# Altium project Driver_Modulation.PrjPcb (part 1 of 2)
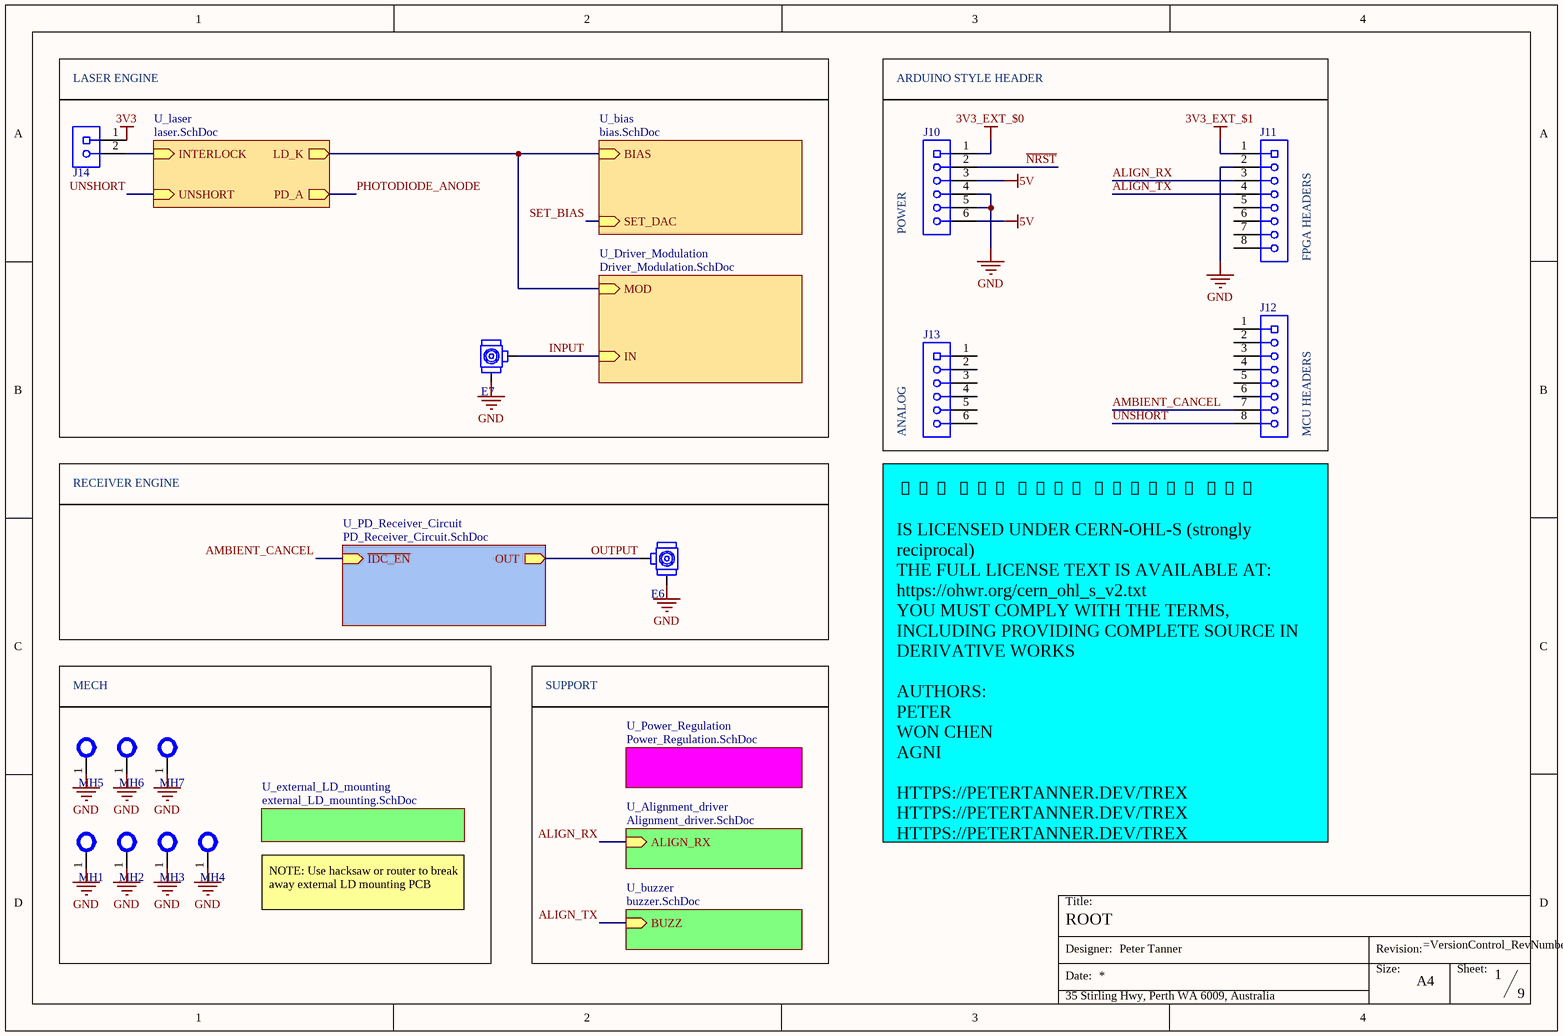
[diagram p0: ROOT.SchDoc]
9 sheets, 150 parts. Net scope: hierarchical (ports join the sheet entries above them; power ports are global).
Board file: Driver_Modulation.PcbDoc
Sheets:
  ROOT.SchDoc
    U_laser = laser.SchDoc
    U_bias = bias.SchDoc
    U_Driver_Modulation = Driver_Modulation.SchDoc
    U_Power_Regulation = Power_Regulation.SchDoc
    U_PD_Receiver_Circuit = PD_Receiver_Circuit.SchDoc
    U_Alignment_driver = Alignment_driver.SchDoc
    U_buzzer = buzzer.SchDoc
    U_external_LD_mounting = external_LD_mounting.SchDoc

## Sheet ROOT.SchDoc: ROOT
size A4; Author: Peter Tanner; SheetNumber: 1; SheetTotal: 9; SPICEModelCacheOJDLQUBK: <root> / <DocumentId>OJDLQUBK</DocumentId> / </root>

### Parts
E6  U.FL-R-SMT-1(01)  [HRS-U.FL-R-SMT-3_V 4_LAYER_KO]  (value not drawn)
E7  U.FL-R-SMT-1(01)  [HRS-U.FL-R-SMT-3_V 4_LAYER_KO]  (value not drawn)
J10  68000-406HLF  [68000-406HLF-Footprint-1]  (value not drawn)
J11  22-28-4080  [22-28-4080-Footprint-1]  (value not drawn)
J12  22-28-4080  [22-28-4080-Footprint-1]  (value not drawn)
J13  68000-406HLF  [68000-406HLF-Footprint-1]  (value not drawn)
J14  22-28-4020  [22-28-4020-Footprint-1]  (value not drawn)
MH1  Mounting hole M3  [Mounting hole M3-Footprint-1]  (value not drawn)  (no BOM)
MH2  Mounting hole M3  [Mounting hole M3-Footprint-1]  (value not drawn)  (no BOM)
MH3  Mounting hole M3  [Mounting hole M3-Footprint-1]  (value not drawn)  (no BOM)
MH4  Mounting hole M3  [Mounting hole M3-Footprint-1]  (value not drawn)  (no BOM)
MH5  Mounting hole M3  [Mounting hole M3-Footprint-1]  (value not drawn)  (no BOM)
MH6  Mounting hole M3  [Mounting hole M3-Footprint-1]  (value not drawn)  (no BOM)
MH7  Mounting hole M3  [Mounting hole M3-Footprint-1]  (value not drawn)  (no BOM)

### Blocks framed on the sheet
LASER ENGINE: E7 J14
RECEIVER ENGINE: E6
MECH: MH1-MH7

### Sub-sheets
U_Alignment_driver = Alignment_driver.SchDoc: ALIGN_RX (in)
U_bias = bias.SchDoc: BIAS (in), SET_DAC (in)
U_buzzer = buzzer.SchDoc: BUZZ (in)
U_Driver_Modulation = Driver_Modulation.SchDoc: IN (in), MOD (in)
U_external_LD_mounting = external_LD_mounting.SchDoc: no entries
U_laser = laser.SchDoc: PD_A (out), LD_K (out), UNSHORT (in), INTERLOCK (in)
U_PD_Receiver_Circuit = PD_Receiver_Circuit.SchDoc: OUT (out), ~{IDC_EN} (in)
U_Power_Regulation = Power_Regulation.SchDoc: no entries

### Nets
3V3: J14.1
3V3_EXT_$0: J10.1
3V3_EXT_$1: J11.1
5V: J10.3 J10.6
GND: E6.2(GND) E7.2(GND) J10.4 J10.5 J11.2 MH1.1 MH2.1 MH3.1 MH4.1 MH5.1 MH6.1 MH7.1
~{NRST}: J10.2
ALIGN_RX: J11.3 ; sheet U_Alignment_driver/ALIGN_RX
ALIGN_TX: J11.4 ; sheet U_buzzer/BUZZ
AMBIENT_CANCEL: J12.7 ; sheet U_PD_Receiver_Circuit/~{IDC_EN}
INPUT: E7.1(SIG) ; sheet U_Driver_Modulation/IN
LD_K: sheet U_laser/LD_K, sheet U_bias/BIAS, sheet U_Driver_Modulation/MOD
OUTPUT: E6.1(SIG) ; sheet U_PD_Receiver_Circuit/OUT
UNSHORT: J12.8 ; sheet U_laser/UNSHORT
NetJ14_2: J14.2 ; sheet U_laser/INTERLOCK

Not connected (* = marked no-connect by the designer): J11 5 6 7 8; J12 1 2 3 4 5 6; J13 1 2 3 4 5 6

### Notes on the sheet
- ARDUINO STYLE HEADER
- (near J10) POWER
- (near J11) FPGA HEADERS
- (near J13) ANALOG
- (near J12) MCU HEADERS
- SUPPORT
- 🦖🦖🦖 THE TREX SYSTEM 🦖🦖🦖
  IS LICENSED UNDER CERN-OHL-S (strongly reciprocal)
  THE FULL LICENSE TEXT IS AVAILABLE AT:
  https://ohwr.org/cern_ohl_s_v2.txt
  YOU MUST COMPLY WITH THE TERMS, INCLUDING PROVIDING COMPLETE SOURCE IN DERIVATIVE WORKS
  AUTHORS:
  PETER
  WON CHEN
  AGNI
  HTTPS://PETERTANNER.DEV/TREX
  HTTPS://PETERTANNER.DEV/TREX
  HTTPS://PETERTANNER.DEV/TREX
- NOTE: Use hacksaw or router to break away external LD mounting PCB
- Title:
- Designer:
- Date:
- Size:
- Revision:
- A4
- Sheet:
- 35 Stirling Hwy, Perth WA 6009, Australia

### Library data of the parts
E6 E7 = CMP-00380-18: Rf Connectors / Coaxial Connectors SMT Ml Rec Au 50 Ohm W/anti Sldr Wicking UFL; Number of Ports: 1; Dielectric Material: Polymer; Impedance: 50; Mating Cycles: 30; Connector Type: Receptacle,Male Pin; Body Plating: Silver; Center Contact Plating: Gold; Max Frequency: 6GHz; Body Material: Bronze; Lead Free: Lead Free; Series: U.FL; JLC PN: C88374; Contact Material: Brass; Fastening Type: SNAP-ON; Min Operating Temperature: -40°C; RoHS Compliant: Yes; Housing Color: Beige; Depth: 3mm; Contact Plating: Gold; Mount: Surface Mount; Length: 3.1mm; Orientation: Vertical; Termination: Solder; Max Operating Temperature: 90°C; Source: UWAA_Stock
J10 = CMP-00021-4: CONN HEADER 6POS .100 STR TIN; Gender: Male; Insulation Resistance: 5G; Voltage Rating: 1.5kV; Pitch: 2.54mm; Connector Type: Male Pin; Current Rating: 3A; Number of Contacts: 6; Depth: 2.41mm; Orientation: Straight; Max Operating Temperature: 125°C; Number of Rows: 1; Length: 15.24mm; Termination: Solder; Min Operating Temperature: -65°C; Housing Material: Thermoplastic; Contact Material: Bronze; Contact Plating: Tin; Housing Color: Black; RoHS Compliant: Unsure; Source: Aliexpress
J11 J12 = CMP-00439-4: Conn Unshrouded Header HDR 8 POS 2.54mm Solder ST Thru-Hole Bag; Number of Contacts: 8; Voltage Rating: 250V; Contact Resistance: 20m; Gender: Male; Current Rating: 4A; Connector Type: Male Pin; Max Operating Temperature: 75°C; Orientation: Straight; Depth: 2.49mm; Housing Color: Black; Pitch: 2.54mm; Housing Material: Thermoplastic; Min Operating Temperature: 0°C; Contact Material: Brass,Bronze; Contact Plating: Tin; RoHS Compliant: Yes; Number of Rows: 1; Termination: Solder; Mounting Technology: Through-Hole; Source: Aliexpress
J13 = CMP-00021-3: CONN HEADER 6POS .100 STR TIN; Max Voltage Rating (AC): 1.5kV; Contact Post Length: 2.41mm; Gender: Male; Insulation Resistance: 5GR; Pitch: 2.54mm; Connector Type: Male Pin; Current Rating: 3A; Number of Contacts: 6; Depth: 2.41mm; Package Quantity: 100; Packaging: Bulk; Orientation: Straight; REACH SVHC: No SVHC; Contact Gender: Male; Max Operating Temperature: 125°C; Number of Rows: 1; Length: 15.24mm; Termination: Solder; Radiation Hardening: No; Flammability Rating: UL94 V-0; Color: Black; Min Operating Temperature: -65°C; Contact Mating Length: 0.23inch; Voltage Rating: 1.5kV; Housing Material: Thermoplastic; Contact Material: Bronze; Contact Plating: Tin; Mount: Through Hole; Housing Color: Black; Number of Positions: 6
J14 = CMP-00157-5: KK 254 Breakaway Header, Vertical, 2 Circuits, Tin (Sn) Plating, Mating Pin Length 6.09mm 2 POS; Voltage Rating: 250V; Current Rating: 4A; Pitch: 2.54mm; Contact Resistance: 20m; Gender: Male; Connector Type: Male Pin; Number of Contacts: 2; RoHS Compliant: Unsure; Orientation: Straight; Number of Rows: 1; Housing Material: Nylon; Contact Material: Brass,Bronze; Housing Color: Black; Depth: 2.49mm; Source: Aliexpress; Mounting Technology: Through Hole; Max Operating Temperature: 75°C; Contact Plating: Tin; Termination: Solder; Min Operating Temperature: 0°C
MH1-MH7 = CMP-00600-10: Close fit Di3.2 mm Alt: M3 nut flange

## Sheet laser.SchDoc: Laser
size A4; Author: Peter Tanner; SheetNumber: 6; SheetTotal: 9; SPICEModelCacheEYCFJCLC: <root> / <DocumentId>EYCFJCLC</DocumentId> / <CacheFrame Number="0"> / <Model Name="si2302cds" Kind="CKT"> / <Text>*August 11, 2008 / *Doc. ID: 68508, S-81826, Rev. A / *File Name: Si2302CDS_PS.txt and Si2302CDS_PS.lib / *This document is intended as a SPICE modeling guideline and does not / *constitute a commercial product data sheet.  Designers should refer to the / *appropriate data sheet of the same number for guaranteed specification / *limits. / .SUBCKT Si2302CDS D G S / M1  3  GX S S NMOS W=273327u L=0.250u / M2  S  GX S D PMOS W=273327u L=0.235u / RG  G  GX     4 / R1  D  3      RTEMP 18E-3 / CGS GX S      201E-12 / DBD S  D      DBD / *********************************************************** / .MODEL  NMOS       NMOS ( LEVEL  = 3        TOX    = 1.7E-8 / + RS     = 18E-3          RD     = 0        NSUB   = 2.45E17 / + KP     = 2.8E-5         UO     = 650 / + VMAX   = 0              XJ     = 5E-7     KAPPA  = 3E-2 / + ETA    = 1E-4           TPG    = 1 / + IS     = 0              LD     = 0 / + CGSO   = 0              CGDO   = 0        CGBO   = 0 / + NFS    = 0.8E12         DELTA  = 0.1) / ************************************************************ / .MODEL  PMOS       PMOS ( LEVEL  = 3        TOX    = 1.7E-8 / +NSUB    = 2E17           IS     = 0        TPG    = -1) / ************************************************************ / .MODEL DBD D (CJO=60E-12 VJ=0.38 M=0.26 / +FC=0.5 TT=4.71E-8 T_MEASURED=25 BV=21 / +RS=4.856e-02 N=1.214 IS=5.289e-09 IKF=1000 / +EG=5.600e-01 XTI=8.258 TRS1=2.944e-12) / ************************************************************ / .MODEL RTEMP RES (TC1=8E-3 TC2=5.5E-6) / ************************************************************ / .ENDS</Text> / </Model> / <Model Name="di_1n5819" Kind="MDL"> / <Text>*SRC=1N5819;DI_1N5819;Diodes;Si;  40.0V  1.00A  3.00us   Diodes Inc. Schottky Barrier Rectifier / .MODEL DI_1N5819 D  ( IS=390n RS=0.115 BV=40.0 IBV=1.00m / + CJO=203p  M=0.333 N=1.70 TT=4.32u )</Text> / </Model> / </CacheFrame> / </root>
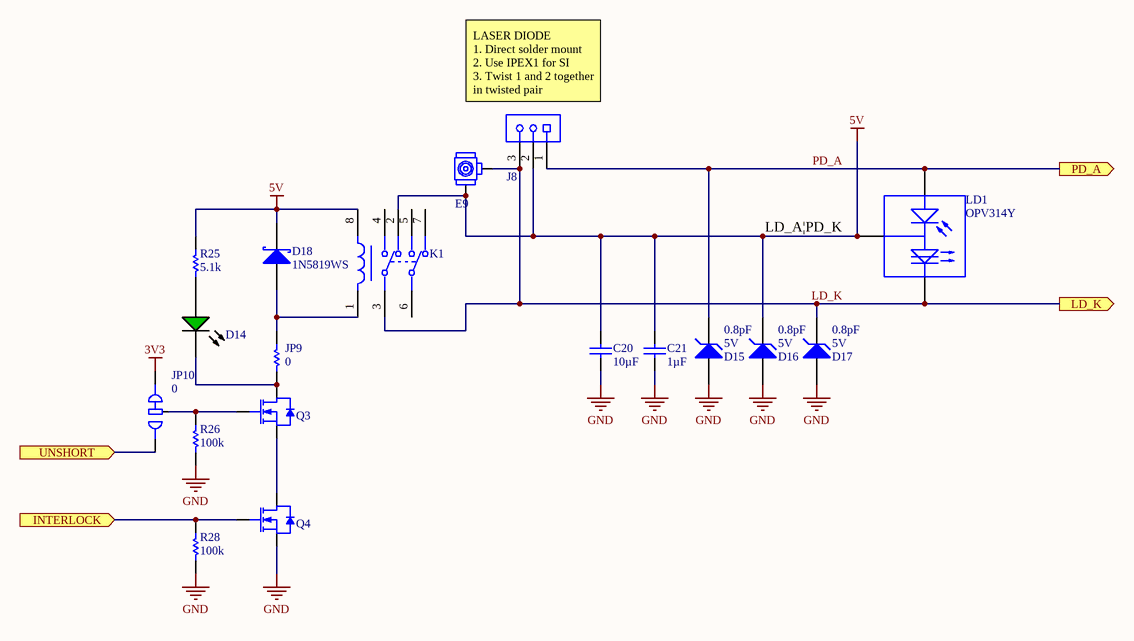
[diagram p1: laser.SchDoc]

### Parts
C20  value 10µF  [CAPC1005X06N]  (hidden comment: CL05A106MQ5NUNC)
C21  value 1µF  [CAPC1005X06N]  (hidden comment: CL05A105KA5NQNC)
D14  KT-0805G  [LED_0805]  (value not drawn)
D15  value 5V  Capacitance: 0.8pF  [DFN60P100X45-2L]  (hidden comment: H5VU10U)
D16  value 5V  Capacitance: 0.8pF  [DFN60P100X45-2L]  (hidden comment: H5VU10U)
D17  value 5V  Capacitance: 0.8pF  [DFN60P100X45-2L]  (hidden comment: H5VU10U)
D18  1N5819WS  [SODFL250X100-2N]
E9  U.FL-R-SMT-1(01)  [HRS-U.FL-R-SMT-3_V 4_LAYER_KO]  (value not drawn)
J8  B3B-PH-K-S(LF)(SN)  [JST-B3B-PH-K-S-3_V]  (value not drawn)
JP9  value 0  [RESC1005X04N]  (hidden comment: 0402WGF0000TCE)
JP10  value 0  [RESC1005X04N TWO STATE]  (hidden comment: JUMPER-0402 TWO STATE)
K1  AGQ200A4HX  [FP-AGQ200S03Z-MFG]  (value not drawn)
LD1  OPV314Y  [TO-18]
Q3  MDD2302  [SOT95P252X140-3N]  (value not drawn)
Q4  MDD2302  [SOT95P252X140-3N]  (value not drawn)
R25  value 5.1k  [RESC1005X04N]  (hidden comment: 0402WGF5101TCE)
R26  value 100k  [RESC1005X04N]  (hidden comment: CRCW0402100KFKEDC)
R28  value 100k  [RESC1005X04N]  (hidden comment: CRCW0402100KFKEDC)

### Ports
INTERLOCK (in), LD_K (out), PD_A (out), UNSHORT (in)

### Nets
3V3: JP10.2
5V: C20.2 C21.2 D16.1(K) D18.1(K) E9.2(GND) J8.2 K1.2 K1.8 LD1.2(COM) R25.2
GND: C20.1 C21.1 D15.2(A) D16.2(A) D17.2(A) Q4.2(S) R26.1 R28.1
LD_K: D17.1(K) E9.1(SIG) J8.3 K1.3 LD1.1(LD_K) ; port LD_K
PD_A: D15.1(K) J8.1 LD1.3(PD_A) ; port PD_A
UNSHORT: JP10.1 ; port UNSHORT
NetD14_1: D14.1(K) JP9.1 Q3.3(D)
NetD14_2: D14.2(A) R25.1
NetD18_2: D18.2(A) JP9.2 K1.1
NetJ14_2: Q4.1(G) R28.2 ; port INTERLOCK
NetJP10_3: JP10.3(COM) Q3.1(G) R26.2
NetQ3_2: Q3.2(S) Q4.3(D)

Not connected (* = marked no-connect by the designer): K1 4 5 6 7

### Notes on the sheet
- (near J8) LASER DIODE
  1. Direct solder mount
  2. Use IPEX1 for SI
  3. Twist 1 and 2 together in twisted pair
- (near LD1) LD_A|PD_K
- Title:
- Designer:
- Date:
- Size:
- Revision:
- A4
- Sheet:
- 35 Stirling Hwy, Perth WA 6009, Australia

### Library data of the parts
C20 = CMP-00663-2: Cap Ceramic 10uF 6.3V X5R 20% SMD 0402 85°C Paper T/R; Source: JLCPCB(Basic); JLC_PN: C15525; Tolerance: 20%; Case Code (Imperial): 0402; Voltage Rating: 6.3V; RoHS Compliant: Yes; Dielectric: X5R
C21 = CMP-00190-9: Ceramic Capacitor, Multilayer, Ceramic, 25V, 10% +Tol, 10% -Tol, X5R, 15% TC, 1uF, Surface Mount, 0402; JLC_PN: C52923; RoHS Compliant: Yes; Source: JLCPCB(Basic); Voltage Rating: 25V; Case Code (Imperial): 0402; Dielectric: X5R; Tolerance: 10%
D14 = CMP-00712-3: Emerald 0805  Light Emitting Diodes (LED) ROHS green; Forward Voltage: 2.8V; Wavelength: 520nm; Color: Emerald; Source: JLCPCB(Basic); JLC_PN: C2297; Case Code (Imperial): 0805; RoHS Compliant: Unsure
D15-D17 = CMP-00841-4: 5A 55W 16V 9V Unidirectional 5V DFN1006-2L  ESD and Surge Protection (TVS/ESD) ROHS; Breakdown Voltage: 9V; Source: JLCPCB(Basic); JLC_PN: C22395519; Polarity: Unidirectional; RoHS Compliant: Unsure; Package: DFN1006-2L; Peak Pulse Power Dissipation: 55W; Clamping Voltage: 16V
D18 = CMP-00680-5: VR=40V IF=1A 120pF P=250mW; Forward Voltage: 600mV; Forward Current: 1A; Max Reverse Current: 500µA; Max Repetitive Reverse Voltage (Vrrm): 40V; Power Dissipation: 1.5W; Max Forward Surge Current (Ifsm): 25A; Technology: SCHOTTKY; Case/Package: SOD-323; JLC_PN: C191023; RoHS Compliant: Unsure; Source: JLCPCB(Basic)
E9 = CMP-00380-18: as E6 on sheet ROOT; Lead Free: Lead Free; Series: U.FL; JLC PN: C88374; Contact Material: Brass; Fastening Type: SNAP-ON; Min Operating Temperature: -40°C; RoHS Compliant: Yes; Housing Color: Beige; Depth: 3mm; Contact Plating: Gold; Mount: Surface Mount; Length: 3.1mm; Orientation: Vertical; Termination: Solder; Max Operating Temperature: 90°C; Source: UWAA_Stock
J8 = CMP-00693-1: Connector Header, PH Series, 3 Position, 2.00mm, Through Hole, Press-Fit, Solder, Natural; Mated Stacking Heights: 8mm; Voltage Rating (DC): 100V; Contact Post Length: 0.134inch; Gender: Male; Number of Positions: 3; Contact Type: Male Pin; Max Operating Temperature: 85°C; Packaging: Bulk; Insulation Height: 0.236inch; Min Operating Temperature: -25°C; Termination: Press-Fit; Material: Polyamide; Voltage Rating: 100V; Number of Rows: 1; Contact Material: Brass; Contact Shape: Square; Insulation Color: Natural; Weight: 28.349523g; Flammability Rating: UL94 V-0; Insulation Material: Nylon; Fastening Type: Detent; Series: PH; Contact Finish - Mating: TIN; Contact Mating Length: 0.13inch; Lead Free: Lead Free; Connector Type: Header; Mounting Technology: Through Hole
JP9 = CMP-00817-3: Metal Glaze/thick Film, 0.0625W, 0ohm, 0402; Tolerance: 1%; Source: JLCPCB(Basic); Case Code (Imperial): 0402; RoHS Compliant: Unsure; JLC_PN: C17168
JP10 = CMP-009-00003-3: JUMPER-0402 TWO STATE Fixed Resistor, Metal Glaze/thick Film, 0.1W, 0ohm, Surface Mount, 0402; Tolerance: 1%; Power Rating: 100mW; Source: JLCPCB(Basic); JLC_PN: C17168; Case Code (Imperial): 0402; RoHS Compliant: Yes
K1 = CMP-008-00000-1: Electromechanical Relay 4.5VDC 145Ohm 2A DPDT (10.6x8.4x5.4)mm SMD General Purpose Relay; Contact Voltage Rating (AC): 125V; Sealable: WATER PROOF; Electrical Life: 100kcycles; Contact Resistance: 100mΩ; Release Time: 4ms; Coil Power: 140mW; Coil Current: 31mA; Number of Contacts: 2; Coil Voltage (DC): 3.375V; Coil Type: Non-Latching; Insulation Resistance: 1GΩ; Voltage Rating: 110V; Coil Resistance: 145Ω; Relay Type: Telecom; Depth: 8.4mm; Number of Pins: 8; Voltage Rating (AC): 125V; Current Rating: 2A; Height: 5.4mm; Contact Material: Gold, Silver; Max Voltage Rating (AC): 125V; Switching Current: 2A; Mount: Surface Mount; Contact Current Rating: 2A; Operate Time: 4ms; Number of Terminals: 8; Termination: Gull Wing; Response Time: 4ms; Contact Plating: Gold; Source: Distributor; Max Voltage Rating (DC): 110V; RoHS: Compliant; Length: 10.6mm; Throw Configuration: DPDT; Power Consumption: 140mW
LD1 = CMP-00026-00000-4: VCSEL Emitter, 840nm Min, 860nm Max, 2500Mbps, TO-46, Through Hole Mount; Max Supply Voltage: 2.2V; Supply Current: 15mA; Body Height: 3.66mm; Operating Wavelength-Nom: 850nm; Threshold Current-Min: 3mA; Body Length or Diameter: 4.67mm; Transmission Type: Digital; Fall Time-Max: 0.1ns; Min Supply Voltage: 1.6V; Spectral Width: 0.85nm; Built-in Feature: MONITOR PHOTODIODE; Number of Channels: 1; Min Operating Temperature: 0°C; Max Operating Temperature: 70°C; Data Rate: 2500Mbps; Package Style: TO-46Meter; RoHS Compliant: Yes; Reach SVHC Compliant: Yes; Operating Wavelength-Max: 860nm; Mounting Technology: Through Hole; Operating Wavelength-Min: 840nm; Fiber Optic Device Type: VCSEL EMITTER; Rise Time: 0.1ns
Q3 Q4 = CMP-00703-4: 4A 25mΩ@4.5V null SOT-23 MOSFETs ROHS N CHANNEL; Max Power Dissipation: 1.25W; Input Capacitance: 340pF; Gate to Source Voltage (Vgs): 12V; Drain to Source Voltage (Vdss): 20V; Threshold Voltage: 1.2V; Rds On Max: 28m; RoHS Compliant: Unsure; Source: JLCPCB(Basic); Type: N channel; JLC_PN: C427390; Continuous Drain Current (ID): 4A; Case/Package: SOT-23
R25 = CMP-00657-3: RESISTOR, 0402 1% 5K1; Power Rating: 0.0625W; Resistance: 5.1kohm; Tolerance, Resistance: ± 1%; Series: MC;...; RoHS Compliant: Unsure; JLC_PN: C25905; Source: JLCPCB(Basic); Tolerance: 1%; Case Code (Imperial): 0402
R26 R28 = CMP-00094-5: RES 100K OHM 1% 1/16W 0402; Power Rating: 62.5mW; Temperature Coefficient: 100ppm/°C; Tolerance: 1%; Case Code (Imperial): 0402; Source: JLCPCB(Basic); JLC_PN: C25741; RoHS Compliant: Unsure

## Sheet bias.SchDoc: Bias Driver
size A4; Author: Peter Tanner; SheetNumber: 5; SheetTotal: 9
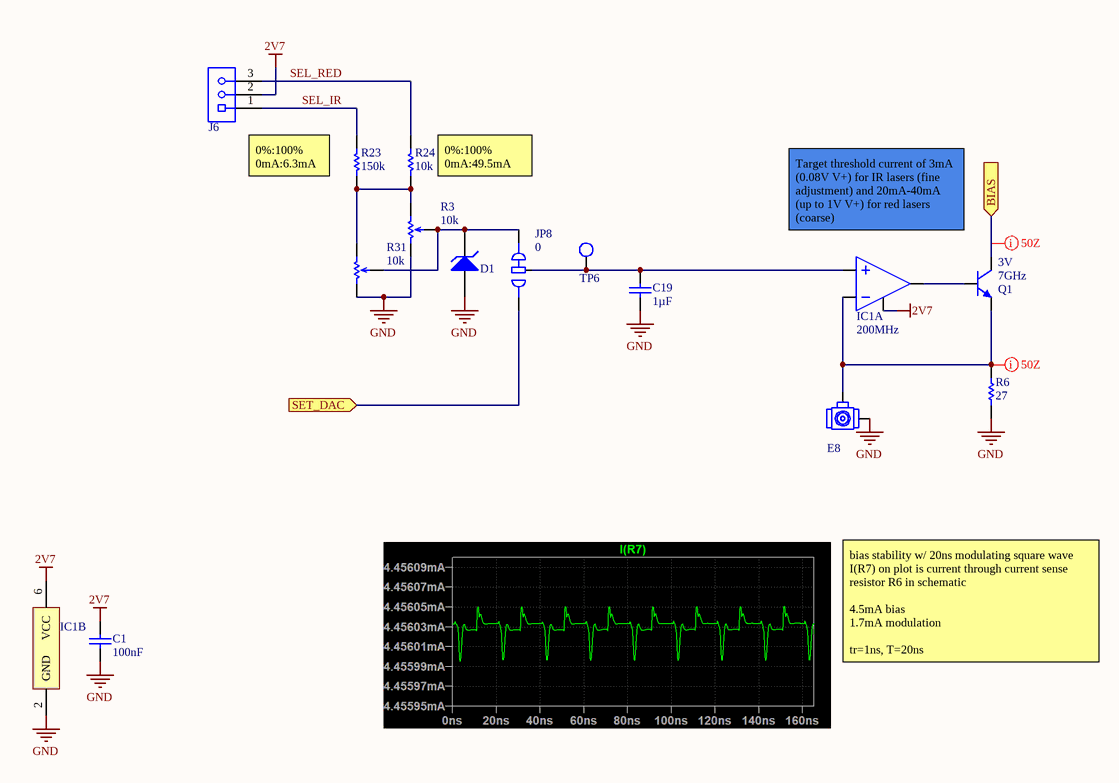
[diagram p2: bias.SchDoc]

### Parts
C1  value 100nF  [CAPC1005X06N]  (hidden comment: CL05B104KB54PNC)
C19  value 1µF  [CAPC1005X06N]  (hidden comment: CL05A105KA5NQNC)
D1  H5VU10U  [DFN60P100X45-2L]  (value not drawn)
E8  U.FL-R-SMT-1(01)  [HRS-U.FL-R-SMT-3_V 4_LAYER_KO]  (value not drawn)
IC1  Gain Bandwidth Product: 200MHz  [DBV0006A_SOT-23-6_TI__SOT95P280X145-6L]  (hidden comment: OPA355NA/3K)  (parts A,B of 2)
J6  10129378-903001BLF  [10129378-903001BLF-Footprint-1]  (value not drawn)
JP8  value 0  [RESC1005X04N TWO STATE]  (hidden comment: JUMPER-0402 TWO STATE)
Q1  Frequency: 7GHz  Emitter Base Voltage (VEBO): 3V  [SOT-23_hongjiacheng__SOT95P240X115-3L]  (hidden comment: 2SC3356)
R3  value 10k  [BOUR-TC33X-2_V]  (hidden comment: TC33X-2-103E)
R6  value 27  [RESC1608X05N]  (hidden comment: ERJ-3GEYJ270V)
R23  value 150k  [RESC2012X05N]  (hidden comment: 0805W8F1503T5E)
R24  value 10k  [RESC2012X05N]  (hidden comment: 0805W8F1002T5E)
R31  value 10k  [POT_RK0971-L-15KC_N-1]  (hidden comment: RK0971114D0B)
TP6  Test Point 5001  [FP-5001-MFG]  (value not drawn)

### Ports
BIAS (in), SET_DAC (in)

### Nets
2V7: C1.2 IC1.5(ENABLE) IC1.6(VCC) J6.2
GND: C1.1 C19.1 D1.2(A) E8.2(GND) IC1.2(GND) R3.1(CCW) R6.1 R31.1(CCW)
LD_K: Q1.1(C) ; port BIAS
SEL_IR: J6.1 R23.2
SEL_RED: J6.3 R24.2
SET_BIAS: JP8.1 ; port SET_DAC
NetC19_2: C19.2 IC1.3(VIN+) JP8.3(COM) TP6.1
NetD1_1: D1.1(K) JP8.2 R3.2(W) R31.2(W)
NetE8_1: E8.1(SIG) IC1.4(VIN-) Q1.3(E) R6.2
NetIC1_1: IC1.1(VOUT) Q1.2(B)
NetR3_3: R3.3(CW) R23.1 R24.1 R31.3(CW)

### Layout directives
net class 50Z: LD_K, NetE8_1

### Notes on the sheet
- 0%:100%
  0mA:6.3mA
- 0%:100%
  0mA:49.5mA
- Target threshold current of 3mA (0.08V V+) for IR lasers (fine adjustment) and 20mA-40mA (up to 1V V+) for red lasers (coarse)
- bias stability w/ 20ns modulating square wave
  I(R7) on plot is current through current sense resistor R6 in schematic
  4.5mA bias
  1.7mA modulation
  tr=1ns, T=20ns
- Title:
- Designer:
- Date:
- Size:
- Revision:
- A4
- Sheet:
- 35 Stirling Hwy, Perth WA 6009, Australia

### Library data of the parts
C1 = CMP-00074-10: Ceramic Capacitor, Multilayer, Ceramic, 50V, 10% +Tol, 10% -Tol, X7R, 15% TC, 0.1uF, Surface Mount, 0402; Dielectric: X7R; RoHS Compliant: Yes; Case Code (Imperial): 0402; Tolerance: 10%; JLC_PN: C307331; Voltage Rating: 50V; Source: JLCPCB(Basic)
C19 = CMP-00190-9: as C21 on sheet laser; JLC_PN: C52923; RoHS Compliant: Yes; Source: JLCPCB(Basic); Voltage Rating: 25V; Case Code (Imperial): 0402; Dielectric: X5R; Tolerance: 10%
D1 = CMP-00841-4: 5A 55W 16V 9V Unidirectional 5V DFN1006-2L  ESD and Surge Protection (TVS/ESD) ROHS; Capacitance: 0.8pF; Breakdown Voltage: 9V; Source: JLCPCB(Basic); Value: 5V; JLC_PN: C22395519; Polarity: Unidirectional; RoHS Compliant: Unsure; Package: DFN1006-2L; Peak Pulse Power Dissipation: 55W; Clamping Voltage: 16V
E8 = CMP-00380-18: as E6 on sheet ROOT; Lead Free: Lead Free; Series: U.FL; JLC PN: C88374; Contact Material: Brass; Fastening Type: SNAP-ON; Min Operating Temperature: -40°C; RoHS Compliant: Yes; Housing Color: Beige; Depth: 3mm; Contact Plating: Gold; Mount: Surface Mount; Length: 3.1mm; Orientation: Vertical; Termination: Solder; Max Operating Temperature: 90°C; Source: UWAA_Stock
IC1 = CMP-00897-1: Operational Amplifier, 1 Func, 9000uV Offset-Max, 100MHz Band Width, CMOS, PDSO6; Output Current per Channel: 60mA; Operating Supply Current: 11mA; Max Supply Voltage: 5.5V; Input Bias Current: 50pA; Input Offset Voltage (Vos): 9mV; Slew Rate: 300V/µs; Power Supply Rejection Ratio (PSRR): 88dB; Min Supply Voltage: 2.7V; Number of Channels: 1; Voltage Gain: 10000; Common Mode Rejection Ratio: 80dB; Source: JLCPCB(Extended,Economic_PCBA); RoHS Compliant: Yes; Quiescent Current: 11mA; Case/Package: SOT-23-6; JLC_PN: C2058090
J6 = CMP-00188-3: Conn Unshrouded Header HDR 3 POS 2.54mm Solder ST Thru-Hole Poly Bag; RoHS Compliant: Unsure; Source: Aliexpress
JP8 = CMP-009-00003-3: as JP10 on sheet laser; Source: JLCPCB(Basic); JLC_PN: C17168; Case Code (Imperial): 0402; RoHS Compliant: Yes
Q1 = CMP-00894-2: RF Small Signal Bipolar Transistor, 0.1A I(C), 1-Element, Ultra High Frequency Band, Silicon, NPN; pin to pad: 1>3 2>1 3>2; Max Collector Current: 100mA; DC Current Gain-Min (hFE): 50; Max Power Dissipation: 200mW; Collector-emitter Voltage Max: 12V; Collector Base Voltage (VCBO): 20V; Source: JLCPCB(Basic); Polarity: NPN; Case/Package: SOT-23; RoHS Compliant: Yes; JLC_PN: C28646266
R3 = CMP-00586-3: Res Trimmer 10K Ohm 25% 1/10W 1(Elec)/1(Mech)Turn (3 X 3.8mm) Foot Print SMD Embossed T/R; Power Rating: 100mW; Temperature Coefficient: 250ppm/°C; Source: JLCPCB(Basic); RoHS Compliant: Unsure; Case Code (Imperial): 0402; Tolerance: 25%
R6 = CMP-00490-4: Res Thick Film 0603 27 Ohm 5% 1/10W +/-200ppm/ßC Molded SMD Punched Carrier T/R; Power Rating: 100mW; Voltage Rating: 75V; Temperature Coefficient: 200ppm/°C; Source: JLCPCB(Basic); Case Code (Imperial): 0603; JLC_PN: C25190; RoHS Compliant: Yes; Tolerance: 5%
R23 = CMP-077-000023-1: Thick Film Resistors - SMD RMC 0805 1/8W 1% T/R-5000; Voltage Rating: 150V; Power Rating: 125mW; RoHS Compliant: Unsure; JLC_PN: C17470; Tolerance: 1%; Source: JLCPCB(Basic); Case Code (Imperial): 0402
R24 = CMP-077-000024-1: Res Thick Film 0805 10K Ohm 1% 0.125W(1/8W) ±100ppm/C Pad SMD T/R; Voltage Rating: 150V; Power Rating: 125mW; Case Code (Imperial): 0805; JLC_PN: C17414; Tolerance: 1%; Source: JLCPCB(Basic); RoHS Compliant: Unsure
R31 = CMP-077-000032-3: Potentiometer, 0.05W, 10000ohm, 10V, 20% +/-Tol, 1 Turn(s); Power Rating: 50mW; RoHS Compliant: Unsure; Case Code (Imperial): N/A; Voltage Rating: 10V; Tolerance: 20%; Source: Aliexpress
TP6 = CMP-001-0013-1: MS27478 - Connectors Receptacle Electrical Solder Mounting Solder Type Hermetic Seal 38999 Series II Test Point; Voltage Rating: 0V; Current Rating: 0A; Number of Contacts: 1; Contact Material: Silver; RoHS Compliant: Unsure; Housing Color: Black; Height: 4.72mm; Length: 7.62mm; Orientation: Straight; Termination: Through Hole; Gender: -; Mounting Technology: Through Hole; Number of Rows: 1; Source: UWAA_Stock; Contact Plating: Tin

## Sheet Driver_Modulation.SchDoc: Modulation Driver
size A4; Author: Peter Tanner; SheetNumber: 3; SheetTotal: 9; SPICEModelCacheFEZYSCPS: <root> / <DocumentId>FEZYSCPS</DocumentId> / </root>
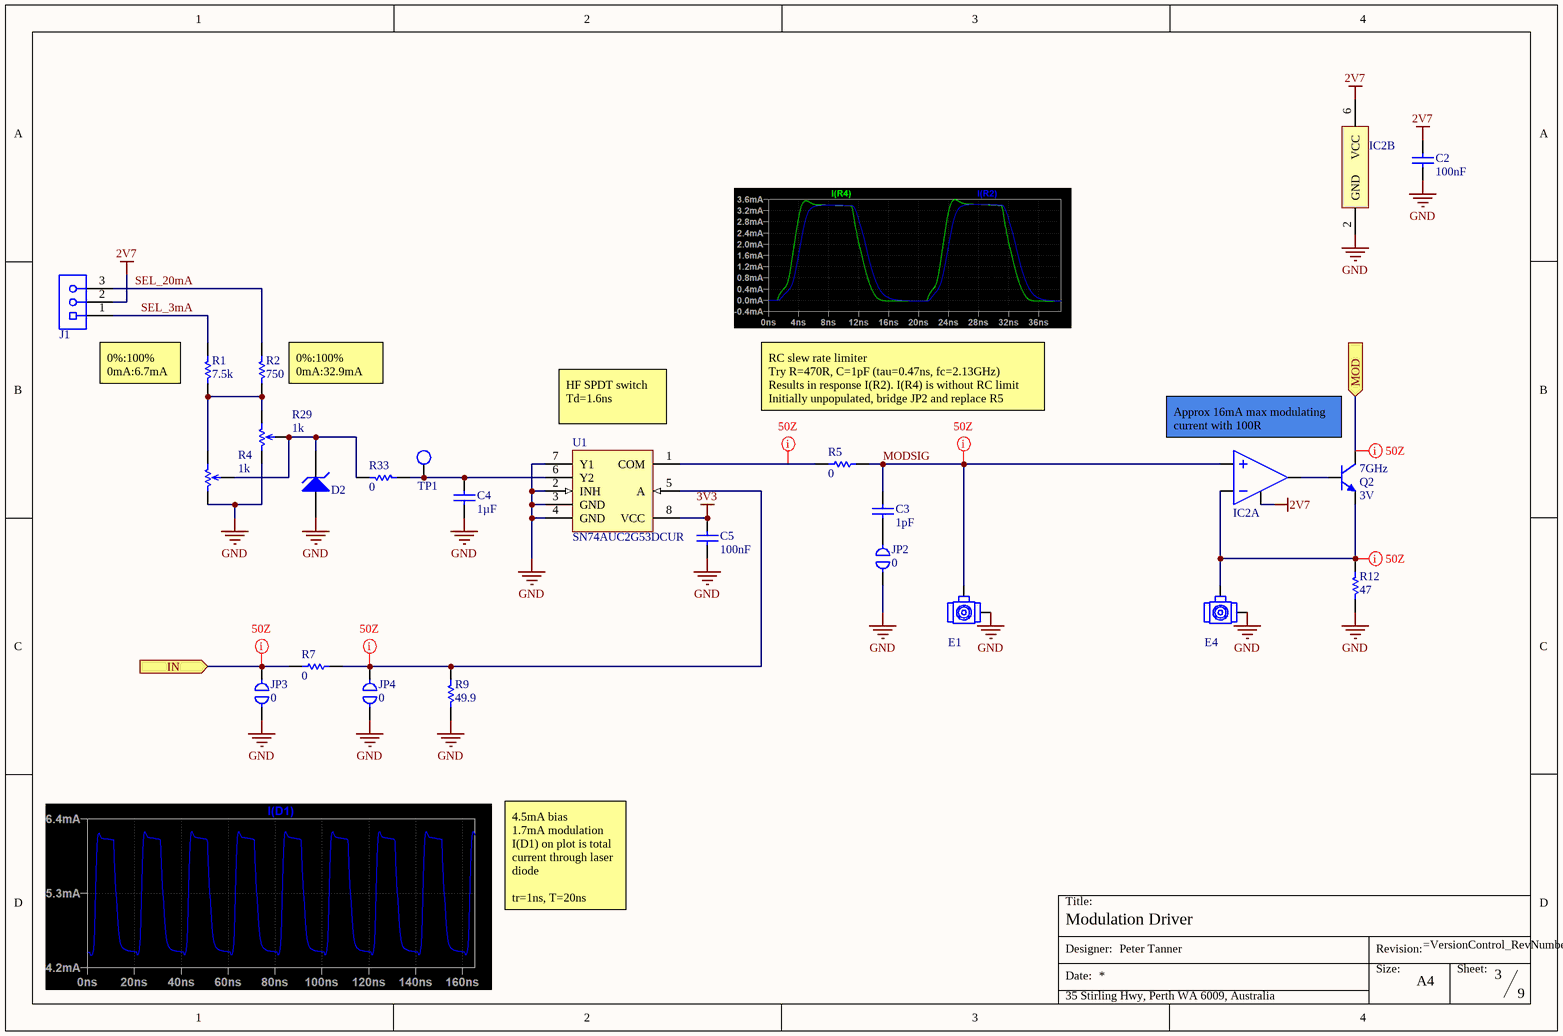
[diagram p3: Driver_Modulation.SchDoc]

### Parts
C2  value 100nF  [CAPC1005X06N]  (hidden comment: CL05B104KB54PNC)
C3  value 1pF  [CAPC1005X06N]  (hidden comment: GCM1555C1H1R0JA16D)
C4  value 1µF  [CAPC1005X06N]  (hidden comment: CL05A105KA5NQNC)
C5  value 100nF  [CAPC1005X06N]  (hidden comment: CL05B104KB54PNC)
D2  H5VU10U  [DFN60P100X45-2L]  (value not drawn)
E1  U.FL-R-SMT-1(01)  [HRS-U.FL-R-SMT-3_V 4_LAYER_KO]  (value not drawn)
E4  U.FL-R-SMT-1(01)  [HRS-U.FL-R-SMT-3_V 4_LAYER_KO]  (value not drawn)
IC2  OPA355NA/3K  [DBV0006A_SOT-23-6_TI__SOT95P280X145-6L]  (value not drawn)  (parts A,B of 2)
J1  10129378-903001BLF  [10129378-903001BLF-Footprint-1]  (value not drawn)
JP2  value 0  [JUMPER-0402-Footprint-1]  (hidden comment: JUMPER-0402)  (no BOM)
JP3  value 0  [RESC1005X04N]  (hidden comment: JUMPER-0402)  (no BOM)
JP4  value 0  [RESC1005X04N]  (hidden comment: JUMPER-0402)  (no BOM)
Q2  Frequency: 7GHz  Emitter Base Voltage (VEBO): 3V  [SOT-23_hongjiacheng__SOT95P240X115-3L]  (hidden comment: 2SC3356)
R1  value 7.5k  [RESC2012X05N]  (hidden comment: 0805W8F7501T5E)
R2  value 750  [RESC2012X05N]  (hidden comment: 0805W8F7500T5E)
R4  value 1k  [BOUR-TC33X-2_V]  (hidden comment: TC33X-2-102E)
R5  value 0  [RESC1005X04N]  (hidden comment: 0402WGF0000TCE)
R7  value 0  [RESC1005X04N]  (hidden comment: 0402WGF0000TCE)
R9  value 49.9  [RESC1005X04N]  (hidden comment: 0402WGF499JTCE)
R12  value 47  [RESC1608X05N]  (hidden comment: RC0603FR-0747RL)
R29  value 1k  [POT_RK0971-L-15KC_N-1]  (hidden comment: RK097_1K)
R33  value 0  [RESC1005X04N]  (hidden comment: 0402WGF0000TCE)
TP1  Test Point 5001  [FP-5001-MFG]  (value not drawn)
U1  SN74AUC2G53DCUR  [DCU0008A_N]

### Ports
IN (in), MOD (in)

### Nets
2V7: C2.2 IC2.5(ENABLE) IC2.6(VCC) J1.2
3V3: C5.2 U1.8(VCC)
GND: C2.1 C4.1 C5.1 D2.2(A) E1.2(GND) E4.2(GND) IC2.2(GND) JP2.1 JP3.1 JP4.1 R4.1(CCW) R9.1 R12.1 R29.1(CCW) U1.2(INH) U1.3(GND) U1.4(GND) U1.7(Y1)
INPUT: JP3.2 R7.2 ; port IN
LD_K: Q2.1(C) ; port MOD
MODSIG: C3.2 E1.1(SIG) IC2.3(VIN+) R5.1
SEL_3mA: J1.1 R1.2
SEL_20mA: J1.3 R2.2
NetC3_1: C3.1 JP2.2
NetC4_2: C4.2 R33.1 TP1.1 U1.6(Y2)
NetD2_1: D2.1(K) R4.2(W) R29.2(W) R33.2
NetE4_1: E4.1(SIG) IC2.4(VIN-) Q2.3(E) R12.2
NetIC2_1: IC2.1(VOUT) Q2.2(B)
NetJP4_2: JP4.2 R7.1 R9.2 U1.5(A)
NetR1_1: R1.1 R2.1 R4.3(CW) R29.3(CW)
NetR5_2: R5.2 U1.1(COM)

### Layout directives
net class 50Z: INPUT, LD_K, MODSIG, NetE4_1, NetJP4_2, NetR5_2

### Notes on the sheet
- 0%:100%
  0mA:6.7mA
- 0%:100%
  0mA:32.9mA
- (near U1) HF SPDT switch
  Td=1.6ns
- RC slew rate limiter
  Try R=470R, C=1pF (tau=0.47ns, fc=2.13GHz)
  Results in response I(R2). I(R4) is without RC limit
  Initially unpopulated, bridge JP2 and replace R5
- Approx 16mA max modulating current with 100R
- 4.5mA bias
  1.7mA modulation
  I(D1) on plot is total current through laser diode
  tr=1ns, T=20ns
- Title:
- Designer:
- Date:
- Size:
- Revision:
- A4
- Sheet:
- 35 Stirling Hwy, Perth WA 6009, Australia

### Library data of the parts
C2 C5 = CMP-00074-10: as C1 on sheet bias; Dielectric: X7R; RoHS Compliant: Yes; Case Code (Imperial): 0402; Tolerance: 10%; JLC_PN: C307331; Voltage Rating: 50V; Source: JLCPCB(Basic)
C3 = CMP-00086-4: Cap Ceramic 1pF 50V C0G 5% Pad SMD 0402 125C Automotive T/R; RoHS Compliant: Unsure; JLC_PN: C1550; Source: JLCPCB(Basic); Tolerance: 5%; Case Code (Imperial): 0402; Voltage Rating: 50V; Dielectric: C0G
C4 = CMP-00190-9: as C21 on sheet laser; JLC_PN: C52923; RoHS Compliant: Yes; Source: JLCPCB(Basic); Voltage Rating: 25V; Case Code (Imperial): 0402; Dielectric: X5R; Tolerance: 10%
D2 = CMP-00841-4: as D1 on sheet bias; Breakdown Voltage: 9V; Source: JLCPCB(Basic); Value: 5V; JLC_PN: C22395519; Polarity: Unidirectional; RoHS Compliant: Unsure; Package: DFN1006-2L; Peak Pulse Power Dissipation: 55W; Clamping Voltage: 16V
E1 E4 = CMP-00380-18: as E6 on sheet ROOT; Lead Free: Lead Free; Series: U.FL; JLC PN: C88374; Contact Material: Brass; Fastening Type: SNAP-ON; Min Operating Temperature: -40°C; RoHS Compliant: Yes; Housing Color: Beige; Depth: 3mm; Contact Plating: Gold; Mount: Surface Mount; Length: 3.1mm; Orientation: Vertical; Termination: Solder; Max Operating Temperature: 90°C; Source: UWAA_Stock
IC2 = CMP-00897-1: Operational Amplifier, 1 Func, 9000uV Offset-Max, 100MHz Band Width, CMOS, PDSO6; Gain Bandwidth Product: 200MHz; Output Current per Channel: 60mA; Operating Supply Current: 11mA; Max Supply Voltage: 5.5V; Input Bias Current: 50pA; Input Offset Voltage (Vos): 9mV; Slew Rate: 300V/µs; Power Supply Rejection Ratio (PSRR): 88dB; Min Supply Voltage: 2.7V; Number of Channels: 1; Voltage Gain: 10000; Common Mode Rejection Ratio: 80dB; Source: JLCPCB(Extended,Economic_PCBA); RoHS Compliant: Yes; Quiescent Current: 11mA; Case/Package: SOT-23-6; JLC_PN: C2058090
J1 = CMP-00188-3: as J6 on sheet bias; RoHS Compliant: Unsure; Source: Aliexpress
JP2-JP4 = CMP-009-00001-6: 0402 pad placeholder for 0-ohm resistor jumper; Tolerance: 1%; RoHS Compliant: Unsure; Source: Distributor; Case Code (Imperial): 0402
Q2 = CMP-00894-2: RF Small Signal Bipolar Transistor, 0.1A I(C), 1-Element, Ultra High Frequency Band, Silicon, NPN; pin to pad: 1>3 2>1 3>2; Max Collector Current: 100mA; DC Current Gain-Min (hFE): 50; Max Power Dissipation: 200mW; Collector-emitter Voltage Max: 12V; Collector Base Voltage (VCBO): 20V; Source: JLCPCB(Basic); Polarity: NPN; Case/Package: SOT-23; RoHS Compliant: Yes; JLC_PN: C28646266
R1 = CMP-077-000027-1: -55℃~+155℃ 125mW 150V 7.5kΩ Thick Film Resistor ±1% ±100ppm/℃ 0805 Chip Resistor - Surface Mount ROHS; Case Code (Imperial): 0805; Source: JLCPCB(Basic); Voltage Rating: 150V; Temperature Coefficient: ±100ppm/℃; JLC_PN: C17807; Tolerance: 1%; RoHS Compliant: Yes; Power Rating: 125mW
R2 = CMP-077-000036-1: Thick Film Resistors - SMD RMC 0805 1/8W 1% T/R-5000; Voltage Rating: 150V; Temperature Coefficient: ±100ppm/℃; Power Rating: 125mW; Case Code (Imperial): 0402; JLC_PN: C17818; Tolerance: 1%; Source: JLCPCB(Basic); RoHS Compliant: Unsure
R4 = CMP-077-000035-1: SMD 3mm Cermet Trimmer - Leadfree 3MM 1KOHMS 25% 0.1WATT OPEN FRM; Power Rating: 100mW; Temperature Coefficient: 250ppm/°C; Source: JLCPCB(Basic); RoHS Compliant: Unsure; Case Code (Imperial): 0402; Tolerance: 25%
R5 R7 R33 = CMP-00817-3: as JP9 on sheet laser; JLC_PN: C17168; RoHS Compliant: Unsure; Case Code (Imperial): 0402; Source: JLCPCB(Basic)
R9 = CMP-077-000018-1: 62.5mW Thick Film Resistors 50V ±100ppm/℃ ±1% 49.9Ω 0402 Chip Resistor - Surface Mount ROHS; Temperature Coefficient: 200ppm/°C; Power Rating: 62.5mW; Tolerance: 1%; Source: JLCPCB(Basic); RoHS Compliant: Yes; JLC_PN: C25120; Case Code (Imperial): 0402
R12 = CMP-00601-4: Res Thick Film 0603 47 Ohm 1% 0.1W(1/10W) ±100ppm/C Pad SMD T/R; Temperature Coefficient: 100ppm/°C; Voltage Rating: 75V; Power Rating: 100mW; RoHS Compliant: Unsure; JLC_PN: C23182; Tolerance: 1%; Source: JLCPCB(Basic); Case Code (Imperial): 0603
R29 = CMP-077-000037-1: Potentiometer, 0.05W, 1000ohm, 10V, 20% +/-Tol, 1 Turn(s); Power Rating: 50mW; RoHS Compliant: Unsure; Tolerance: 20%; Source: Aliexpress; Voltage Rating: 10V; Case Code (Imperial): N/A
TP1 = CMP-001-0013-1: as TP6 on sheet bias; Contact Material: Silver; RoHS Compliant: Unsure; Housing Color: Black; Height: 4.72mm; Length: 7.62mm; Orientation: Straight; Termination: Through Hole; Gender: -; Mounting Technology: Through Hole; Number of Rows: 1; Source: UWAA_Stock; Contact Plating: Tin
U1 = CMP-071-000018-2: 2.5-V, 2: 1 (SPDT), 1-channel general-purpose analog switch 8-VSSOP -40 to 85; Number of Inputs: 2; Turn-Off Delay Time: 10ns; Max Supply Voltage: 2.7V; Bandwidth: 198MHz; Value: 15Ω; Number of Circuits: 1; Min Supply Voltage: 800mV; Supply Type: Single; Low Level Output Current: 50mA; Turn-On Delay Time: 9.2ns; Operating Supply Current: 10µA; Propagation Delay: 100ps; Mount: Surface Mount; Number of Pins: 8; Radiation Hardening: No; RoHS: Compliant; Source: Distributor; Case/Package: VSSOP; Throw Configuration: SPDT; Number of Bits: 2; Length: 2.3mm; Height: 900µm; Thickness: 850µm; Number of Channels: 2; High Level Output Current: 50mA; Max Supply Current: 10µA

## Sheet Power_Regulation.SchDoc: Power
size A4; Author: Agni, Peter; SheetNumber: 2; SheetTotal: 9; SPICEModelCacheVIAWGOOX: <root> / <DocumentId>VIAWGOOX</DocumentId> / <CacheFrame Number="0"> / <Model Name="di_1n5819" Kind="MDL"> / <Text>*SRC=1N5819;DI_1N5819;Diodes;Si;  40.0V  1.00A  3.00us   Diodes Inc. Schottky Barrier Rectifier / .MODEL DI_1N5819 D  ( IS=390n RS=0.115 BV=40.0 IBV=1.00m / + CJO=203p  M=0.333 N=1.70 TT=4.32u )</Text> / </Model> / </CacheFrame> / </root>
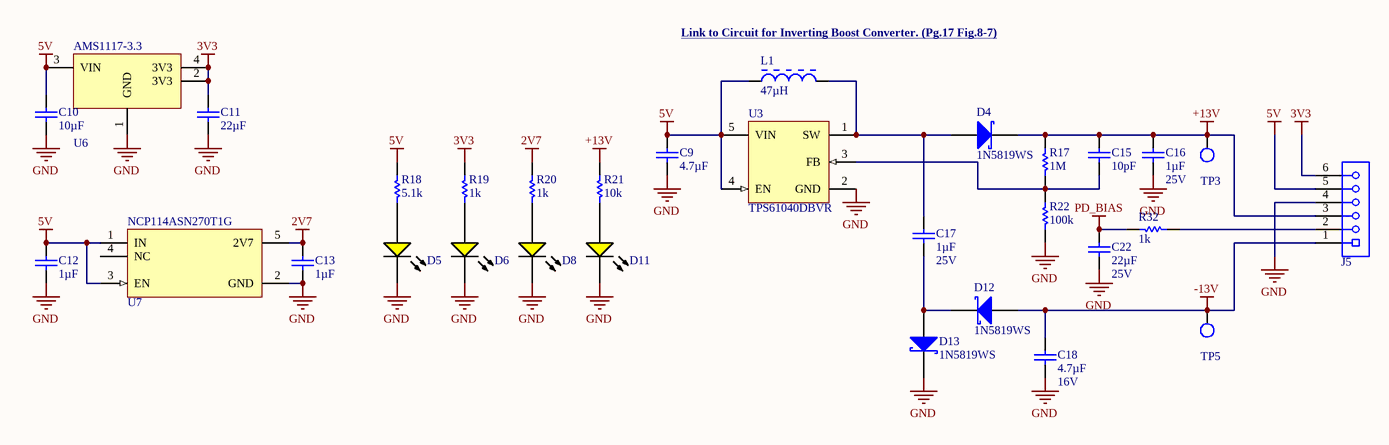
[diagram p4: Power_Regulation.SchDoc]

### Parts
C9  value 4.7µF  [CAPC1608X10N]  (hidden comment: CL10A475KO8NNNC)
C10  value 10µF  [CAPC1005X06N]  (hidden comment: CL05A106MQ5NUNC)
C11  value 22µF  [CAPC1608X10N]  (hidden comment: CL10A226MQ8NRNC)
C12  value 1µF  [CAPC1005X06N]  (hidden comment: CL05A105KA5NQNC)
C13  value 1µF  [CAPC1005X06N]  (hidden comment: CL05A105KA5NQNC)
C15  value 10pF  [CAPC1005X06N]  (hidden comment: CL05C100JB5NNNC)
C16  value 1µF  Voltage Rating: 25V  [CAPC1005X06N]  (hidden comment: CL05A105KA5NQNC)
C17  value 1µF  Voltage Rating: 25V  [CAPC1005X06N]  (hidden comment: CL05A105KA5NQNC)
C18  value 4.7µF  Voltage Rating: 16V  [CAPC1608X10N]  (hidden comment: CL10A475KO8NNNC)
C22  value 22µF  Voltage Rating: 25V  [CAPC2012X14N]  (hidden comment: CL21A226MAQNNNE)
D4  1N5819WS  [SODFL250X100-2N]
D5  KT-0805Y  [LED_0805]  (value not drawn)
D6  KT-0805Y  [LED_0805]  (value not drawn)
D8  KT-0805Y  [LED_0805]  (value not drawn)
D11  KT-0805Y  [LED_0805]  (value not drawn)
D12  1N5819WS  [SODFL250X100-2N]
D13  1N5819WS  [SODFL250X100-2N]
J5  68000-406HLF  [68000-406HLF-Footprint-1]  (value not drawn)
L1  value 47µH  [INDP5252X48L]  (hidden comment: PCD0504MT470)
R17  value 1M  [RESC1005X04N]  (hidden comment: 0402WGF1004TCE)
R18  value 5.1k  [RESC1005X04N]  (hidden comment: 0402WGF5101TCE)
R19  value 1k  [RESC1005X04N]  (hidden comment: CRCW04021K00FKEDC)
R20  value 1k  [RESC1005X04N]  (hidden comment: CRCW04021K00FKEDC)
R21  value 10k  [RESC1005X04N]  (hidden comment: CRCW0402-10K0FKED)
R22  value 100k  [RESC1005X04N]  (hidden comment: CRCW0402100KFKEDC)
R32  value 1k  [RESC1005X04N]  (hidden comment: CRCW04021K00FKEDC)
TP3  Test Point 5001  [FP-5001-MFG]  (value not drawn)
TP5  Test Point 5001  [FP-5001-MFG]  (value not drawn)
U3  TPS61040DBVR  [DBV0005A_L]
U6  AMS1117-3.3  [1117_REG_SOT223__SOT230P700X180-4L]
U7  NCP114ASN270T1G  [SOT95P280X110-5N]

### Nets
2V7: C13.2 R20.2 U7.5(2V7)
3V3: C11.2 J5.6 R19.2 U6.2(3V3) U6.4(3V3)
5V: C9.2 C10.2 C12.2 J5.5 L1.1 R18.2 U3.4(EN) U3.5(VIN) U6.3(VIN) U7.1(IN) U7.3(EN)
+13V: C15.2 C16.2 D4.1(K) J5.3 R17.1 R21.2 TP3.1
-13V: C18.2 D12.2(A) J5.1 TP5.1
GND: C9.1 C10.1 C11.1 C12.1 C13.1 C16.1 C18.1 C22.1 D5.1(K) D6.1(K) D8.1(K) D11.1(K) D13.1(K) J5.4 R22.2 U3.2(GND) U6.1(GND) U7.2(GND)
PD_BIAS: C22.2 R32.1
NetC15_1: C15.1 R17.2 R22.1 U3.3(FB)
NetC17_1: C17.1 D12.1(K) D13.2(A)
NetC17_2: C17.2 D4.2(A) L1.2 U3.1(SW)
NetD5_2: D5.2(A) R18.1
NetD6_2: D6.2(A) R19.1
NetD8_2: D8.2(A) R20.1
NetD11_2: D11.2(A) R21.1
NetJ5_2: J5.2 R32.2

Not connected (* = marked no-connect by the designer): U7 4(NC)

### Notes on the sheet
- (near L1) Link to Circuit for Inverting Boost Converter. (Pg.17 Fig.8-7) <https://www.ti.com/lit/ds/symlink/tps61041.pdf>
- Title:
- Designer:
- Date:
- Size:
- Revision:
- A4
- Sheet:
- 35 Stirling Hwy, Perth WA 6009, Australia

### Library data of the parts
C9 C18 = CMP-00044-4: 16V 4.7uF X5R ±10% 0603 Multilayer Ceramic Capacitors MLCC - SMD/SMT ROHS; Source: JLCPCB(Basic); JLC_PN: C19666; Case Code (Imperial): 0603; RoHS Compliant: Unsure; Tolerance: 10%; Dielectric: X5R
  C9: Voltage Rating: 16V
C10 = CMP-00663-2: as C20 on sheet laser; Source: JLCPCB(Basic); JLC_PN: C15525; Tolerance: 20%; Case Code (Imperial): 0402; Voltage Rating: 6.3V; RoHS Compliant: Yes; Dielectric: X5R
C11 = CMP-00700-2: Multilayer Ceramic Capacitor, 22 uF, 6.3 V, ± 20%, X5R, 0603 [1608 Metric]; Voltage Rating: 6.3V; Source: JLCPCB(Basic); Dielectric: X5R; RoHS Compliant: Yes; JLC_PN: C59461; Case Code (Imperial): 0603; Tolerance: 20%
C12 C13 C16 C17 = CMP-00190-9: as C21 on sheet laser; JLC_PN: C52923; RoHS Compliant: Yes; Source: JLCPCB(Basic); Case Code (Imperial): 0402; Dielectric: X5R; Tolerance: 10%
  C12 C13: Voltage Rating: 25V
C15 = CMP-00653-3: Multilayer Ceramic Capacitor, 10 pF, 50 V, ± 5%, C0G (NP0), 0402 [1005 Metric]; Voltage Rating: 50V; Dielectric: C0G; JLC_PN: C32949; Source: JLCPCB(Basic); Case Code (Imperial): 0402; RoHS Compliant: Yes; Tolerance: 5%
C22 = CMP-00128-5: Ceramic Capacitor, Multilayer, Ceramic, 25V, 20% +Tol, 20% -Tol, X5R, 15% TC, 22uF, Surface Mount, 0805; RoHS Compliant: Yes; Case Code (Imperial): 0805; Source: JLCPCB(Basic); Dielectric: X5R; JLC_PN: C45783; Tolerance: 20%
D4 D12 D13 = CMP-00680-5: as D18 on sheet laser; Technology: SCHOTTKY; Case/Package: SOD-323; JLC_PN: C191023; RoHS Compliant: Unsure; Source: JLCPCB(Basic)
D5 D6 D8 D11 = CMP-00852-3: Yellow 0805 LED Indication - Discrete ROHS; Forward Voltage: 2.2V; Luminous Intensity: 113mcd; Wavelength: 594nm; JLC_PN: C2296; RoHS Compliant: Unsure; Source: JLCPCB(Basic); Case Code (Imperial): 0805; Color: Yellow
J5 = CMP-00021-4: CONN HEADER 6POS .100 STR TIN; Pitch: 2.54mm; Current Rating: 3A; Connector Type: Male Pin; Gender: Male; Number of Contacts: 6; Insulation Resistance: 5G; Voltage Rating: 1.5kV; RoHS Compliant: Unsure; Min Operating Temperature: -65°C; Number of Rows: 1; Max Operating Temperature: 125°C; Orientation: Straight; Source: Aliexpress; Depth: 2.41mm; Contact Material: Bronze; Length: 15.24mm; Contact Plating: Tin; Housing Color: Black; Housing Material: Thermoplastic; Termination: Solder
L1 = CMP-00916-1: General Purpose Inductor, 47uH, 20%, 1 Element, SMD, 2320; Shielding: No; Core Material: Ferrite; Current Rating: 720mA; Test Frequency: 1kHz; Saturation Current: 1.1A; DC Resistance (DCR): 0.37; Tolerance: 20%; RoHS Compliant: Yes; Source: UWAA_Stock; Case Code (Imperial): N/A
R17 = CMP-00319-8: Fixed Resistor, Metal Glaze/thick Film, 0.0625W, 1000000ohm, 50V, 1% +/-Tol, 100ppm/Cel, Surface Mount, 0402; Power Rating: 62.5mW; Temperature Coefficient: -100100ppm/°C; JLC_PN: C26083; Case Code (Imperial): 0402; Tolerance: 1%; RoHS Compliant: Yes; Source: JLCPCB(Basic)
R18 = CMP-00657-3: as R25 on sheet laser; RoHS Compliant: Unsure; JLC_PN: C25905; Source: JLCPCB(Basic); Tolerance: 1%; Case Code (Imperial): 0402
R19 R20 R32 = CMP-00098-5: RES 1K OHM 1% 1/16W 0402; Power Rating: 62.5mW; Temperature Coefficient: 100ppm/°C; RoHS Compliant: Unsure; JLC_PN: C11702; Source: JLCPCB(Basic); Tolerance: 1%; Case Code (Imperial): 0402
R21 = CMP-00515-7: Res Thick Film 0402 10K Ohm 1% 1/16W ±100ppm/°C Molded SMD Paper T/R; Voltage Rating: 50V; Power Rating: 63mW; RoHS Compliant: Unsure; JLC_PN: C25744; Source: JLCPCB(Basic); Tolerance: 1%; Case Code (Imperial): 0402; Temperature Coefficient: 100ppm/°C
R22 = CMP-00094-5: as R26 on sheet laser; Tolerance: 1%; Source: JLCPCB(Basic); JLC_PN: C25741; RoHS Compliant: Unsure; Case Code (Imperial): 0402
TP3 TP5 = CMP-001-0013-1: as TP6 on sheet bias; Contact Material: Silver; RoHS Compliant: Unsure; Housing Color: Black; Height: 4.72mm; Length: 7.62mm; Orientation: Straight; Termination: Through Hole; Gender: -; Mounting Technology: Through Hole; Number of Rows: 1; Source: UWAA_Stock; Contact Plating: Tin
U3 = CMP-00672-2: Conv DC-DC 1.8V to 6V Step Up Single-Out 1.8V to 28V 0.4A 5-Pin SOT-23 T/R; Quiescent Current: 28uA; Current Rating: 28mA; Number of Outputs: 1; Output Current per Channel: 350mA; Output Power: 357mW; Dimming: PWM; Topology: Boost; Output Current: 400mA; Efficiency: 86%; Operating Frequency: 1 MHz; Switching Frequency: 1MHz; Output Type: Adjustable; Max Supply Current: 50uA; Max Output current: 90mA; Radiation Hardening: No; Min Output Voltage: 1.8V; Weight: 0.000459oz; RoHS Compliant: Yes; Min Input Voltage: 1.8V; Number of Channels: 1; Min Supply Voltage: 1.8V; Width: 1.6mm; Series: -; Reach SVHC Compliant: No; Max Supply Voltage: 6V; Case/Package: SOT-23-5; Packaging: Tape and Reel; Thickness: 1.2mm; Output Voltage: 28V; Max Output Voltage: 28V; Package Quantity: 3000; JLC_PN: C7722; Max Operating Temperature: 85°C; Pins: 5; Min Operating Temperature: -40°C; Frequency: 1MHz; Termination: SMD/SMT; Lead Free: Lead Free; High Level Output Current: 90mA; Source: JLCPCB(Basic)
U6 = CMP-001-0007-3: Gull Wing EAR99 Fixed Positive Single Output Ldo Regulator Dual Voltage Regulator Linear 125C 1.2W 1A 1.8MM; Number of Outputs: 1; Nominal Supply Current: 5mA; Output Voltage: 3.3V; Dropout Voltage: 1.1V; Max Supply Voltage: 15V; Pins: 2; Height: 1.8mm; Max Power Dissipation: 1.2W; Max Operating Temperature: 125°C; Output Current: 1A; Min Operating Temperature: -40°C; JLC_PN: C6186; RoHS Compliant: Yes; Case/Package: SOT-223; Source: JLCPCB(Basic)
U7 = CMP-077-000020-1: LDO Voltage Regulator, Fixed, 1.7V to 5.5V, Single Output, 170mV, 2.7V, 300mA, 5 Pins, TSOP; Min Input Voltage: 3.2V; Max Power Dissipation: 250mW; Dropout Voltage: 135mV; Power Supply Rejection Ratio (PSRR): 40dB; Polarity: Positive; Accuracy: 1%; Number of Regulators: 1; Max Input Voltage: 5.5V; Min Output Voltage: 2.7V; Max Output Voltage: 2.7V; Output Voltage: 2.7V; RoHS Compliant: Unsure; Output Current: 300mA; Source: Distributor; RoHS: Compliant; Output Type: Fixed; Case/Package: SOT-23-5